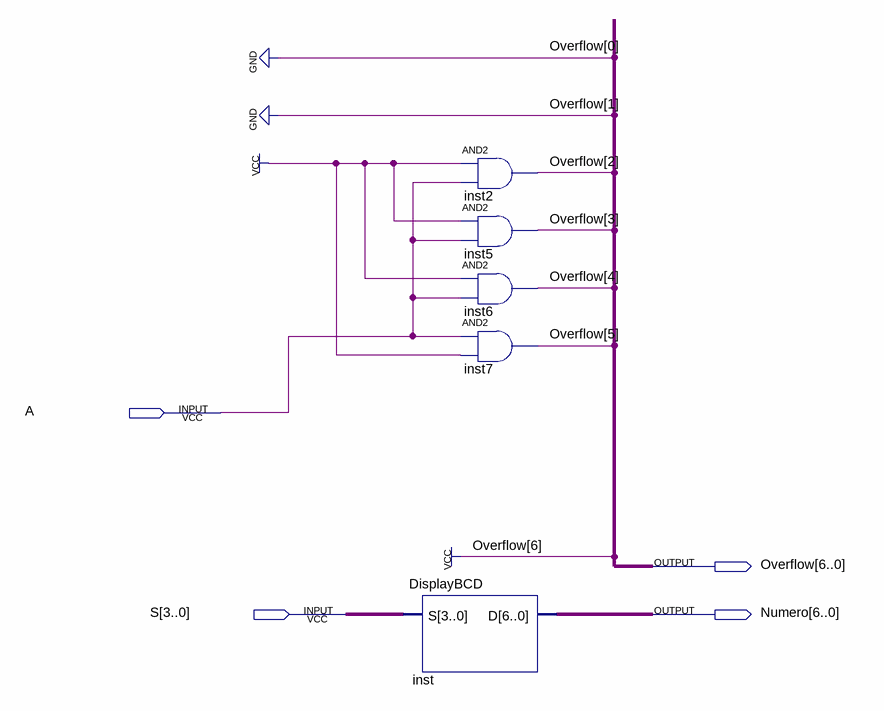
[diagram p0: schematic sheet]
// Quartus schematic DisplayBCDCOMPLETO.bdf as structural Verilog: 5 symbols, 4 pins
module DisplayBCDCOMPLETO (
  input  A,
  input  [3:0] S,
  output [6:0] Overflow,
  output [6:0] Numero
);

  DisplayBCD inst (.S(S), .D(Numero));
  and inst2 (Overflow[2], 1'b1, A);
  and inst5 (Overflow[3], 1'b1, A);
  and inst6 (Overflow[4], 1'b1, A);
  and inst7 (Overflow[5], A, 1'b1);

  assign {Overflow[6], Overflow[1:0]} = 3'b100;
endmodule
